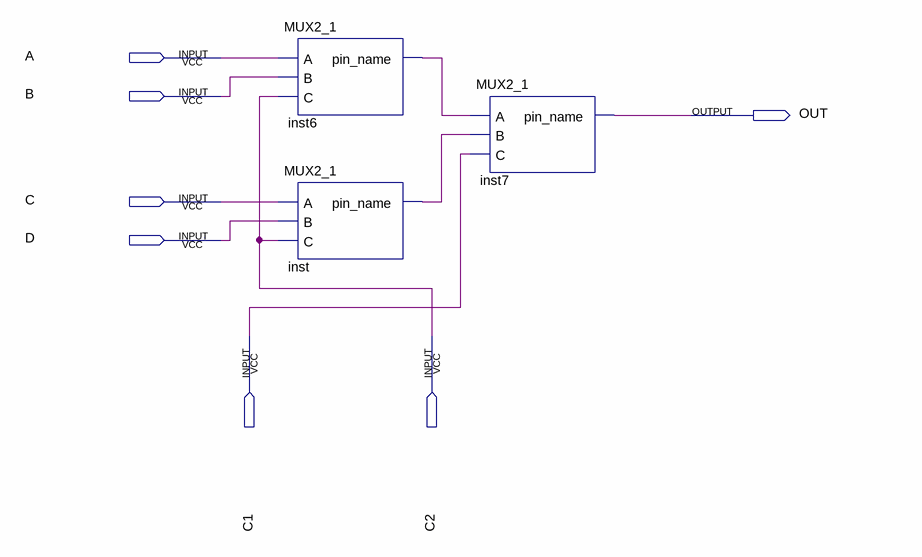
[diagram p0: schematic sheet]
// Quartus schematic MUX4_1.bdf as structural Verilog: 3 symbols, 7 pins
module MUX4_1 (
  input  A,
  input  B,
  input  C,
  input  D,
  input  C1,
  input  C2,
  output OUT
);

  wire inst6_pin_name, inst_pin_name;

  MUX2_1 inst6 (.A(A), .B(B), .C(C2), .pin_name(inst6_pin_name));
  MUX2_1 inst (.A(C), .B(D), .C(C2), .pin_name(inst_pin_name));
  MUX2_1 inst7 (.A(inst6_pin_name), .B(inst_pin_name), .C(C1), .pin_name(OUT));
endmodule
